# Altium schematic sheet TOP.SchDoc
size A4; SheetNumber: 1; SheetTotal: 12
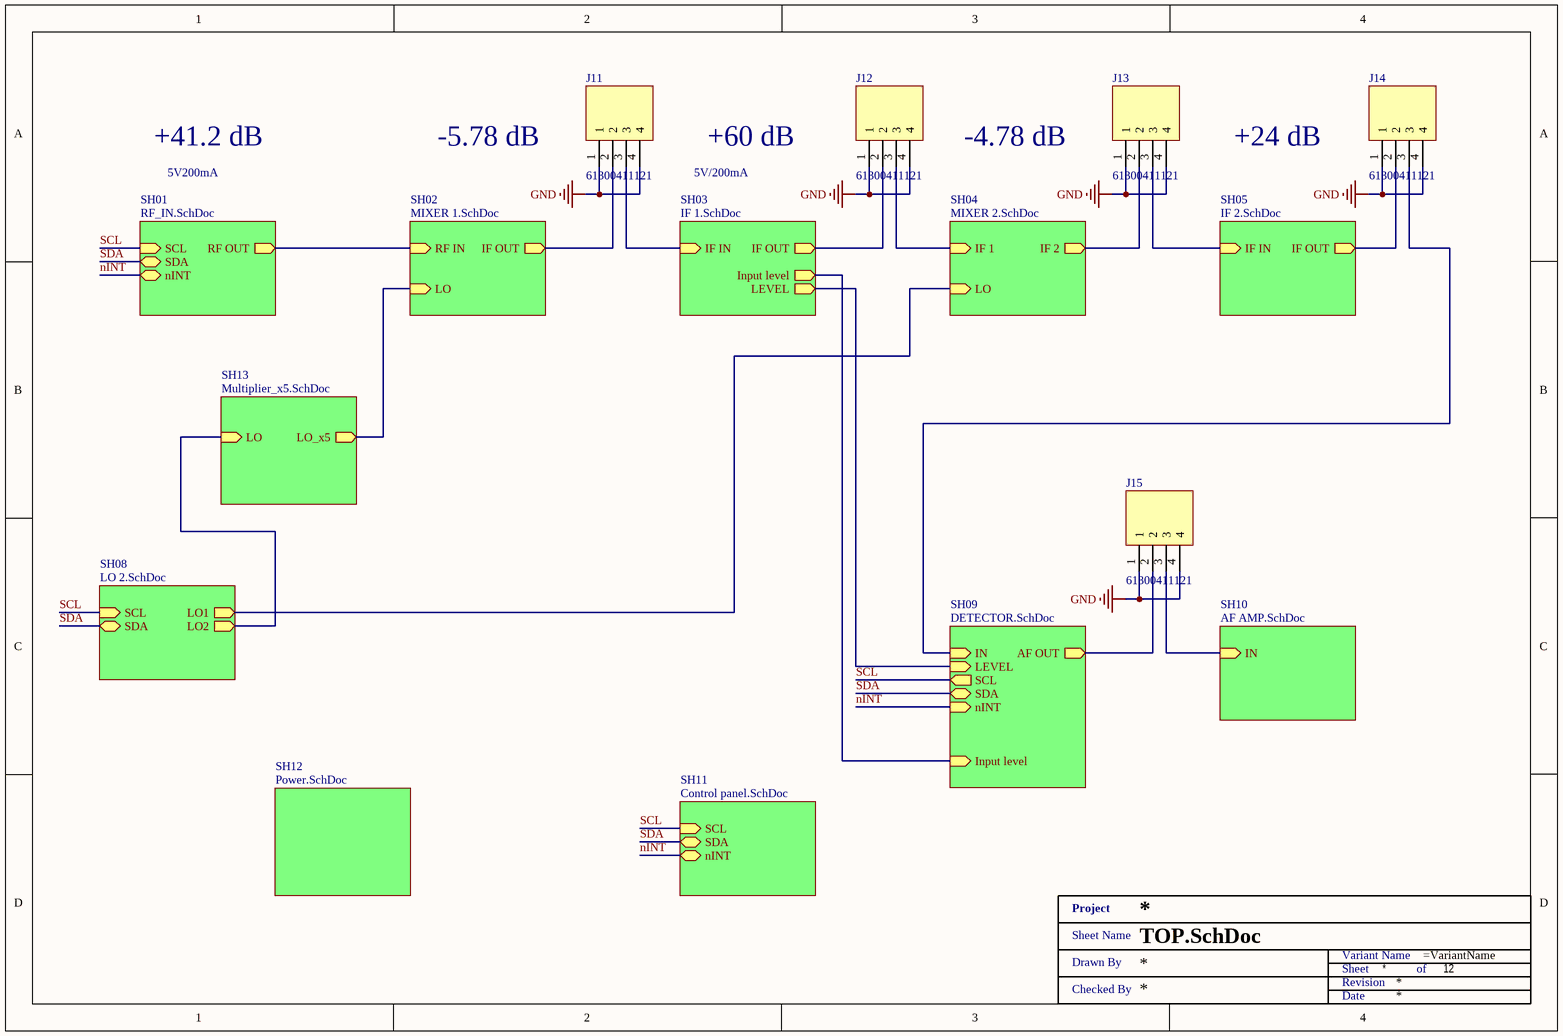
[diagram p0: TOP.SchDoc]

## Parts
J11  61300411121  [Header 4 2.54mm]
J12  61300411121  [Header 4 2.54mm]
J13  61300411121  [Header 4 2.54mm]
J14  61300411121  [Header 4 2.54mm]
J15  61300411121  [Header 4 2.54mm]
XX?  Title 1  (value not drawn)  (graphical)

## Sub-sheets
SH01 = RF_IN.SchDoc: RF OUT (out), SCL (in), SDA (bidir), nINT (bidir)
SH02 = MIXER 1.SchDoc: RF IN (in), IF OUT (out), LO (in)
SH03 = IF 1.SchDoc: IF IN (in), IF OUT (out), LEVEL (out), Input level (out)
SH04 = MIXER 2.SchDoc: IF 1 (in), IF 2 (out), LO (in)
SH05 = IF 2.SchDoc: IF IN (in), IF OUT (out)
SH08 = LO 2.SchDoc: SCL (in), SDA (bidir), LO1 (out), LO2 (out)
SH09 = DETECTOR.SchDoc: IN (in), AF OUT (out), SCL (out), SDA (bidir), nINT (in), LEVEL (in), Input level (in)
SH10 = AF AMP.SchDoc: IN (in)
SH11 = Control panel.SchDoc: SCL (in), SDA (bidir), nINT (bidir)
SH12 = Power.SchDoc: no entries
SH13 = Multiplier_x5.SchDoc: LO_x5 (out), LO (in)

## Nets
GND: J11.1 J11.4 J12.1 J12.4 J13.1 J13.4 J14.1 J14.4 J15.1 J15.4
nINT: sheet SH01/nINT, sheet SH09/nINT, sheet SH11/nINT
SCL: sheet SH01/SCL, sheet SH09/SCL, sheet SH08/SCL, sheet SH11/SCL
SDA: sheet SH01/SDA, sheet SH09/SDA, sheet SH08/SDA, sheet SH11/SDA
NetJ11_2: J11.2 ; sheet SH02/IF OUT
NetJ11_3: J11.3 ; sheet SH03/IF IN
NetJ12_2: J12.2 ; sheet SH03/IF OUT
NetJ12_3: J12.3 ; sheet SH04/IF 1
NetJ13_2: J13.2 ; sheet SH04/IF 2
NetJ13_3: J13.3 ; sheet SH05/IF IN
NetJ14_2: J14.2 ; sheet SH05/IF OUT
NetJ14_3: J14.3 ; sheet SH09/IN
NetJ15_2: J15.2 ; sheet SH09/AF OUT
NetJ15_3: J15.3 ; sheet SH10/IN
(unnamed): sheet SH01/RF OUT, sheet SH02/RF IN
(unnamed): sheet SH02/LO, sheet SH13/LO_x5
(unnamed): sheet SH03/LEVEL, sheet SH09/LEVEL
(unnamed): sheet SH03/Input level, sheet SH09/Input level
(unnamed): sheet SH04/LO, sheet SH08/LO1
(unnamed): sheet SH08/LO2, sheet SH13/LO

## Notes on the sheet
- +41.2 dB
- 5V200mA
- (near J11) -5.78 dB
- 5V/200mA
- +60 dB
- -4.78 dB
- +24 dB
- (in symbol Title 1) Project; Sheet Name; Variant Name; Drawn By; Sheet; of; Revision; Checked By; Date

## Library data of the parts
J11-J15 = 61300411121: CONN HEADER 4 POS 2.54; Manufacturer: Wurth Electronics Inc.; Pitch - Mating: 0.100" (2.54mm); Number of Positions: 4; Number of Positions Loaded: All; Style: Board to Board or Cable; Shrouding: Unshrouded; Contact Length - Mating: 0.236" (6.00mm); Contact Length - Post: 0.118" (3.00mm); Overall Contact Length: 0.454" (11.54mm); Material Flammability Rating: UL94 V-0; Current Rating: 3A; Voltage Rating: 250V; Manufacturer Part Number: 61300411121; RoHS: RoHS Compliant; Category: Connectors, Interconnects; Stock 1: 22863; Pricing 1: 1=0.18, 10=0.153, 25=0.1272, 50=0.106, 100=0.096, 1000=0.088 (USD); Packaging: Bulk; Part Status: Active; Connector Type: Header; Contact Type: Male Pin; Number of Rows: 1; Row Spacing - Mating: -; Mounting Type: Through Hole; Termination: Solder; Fastening Type: Push-Pull; Insulation Height: 0.100" (2.54mm); Contact Shape: Square; Contact Finish - Mating: Gold; Contact Finish Thickness - Mating: -; Contact Finish - Post: -; Contact Material: Copper Alloy; Insulation Material: Polybutylene Terephthalate (PBT); Features: -; Operating Temperature: -40°C ~ 125°C; Ingress Protection: -; Insulation Color: Black; Mated Stacking Heights: -; Contact Finish Thickness - Post: -; Applications: -; ComponentLink1URL: https://katalog.we-online.de/em/datasheet/6130xx11121.pdf; ComponentLink1Description: https://katalog.we-online.de/em/datasheet/6130xx11121.pdf; Supplier 1: Mouser; Supplier Part Number 1: 710-61300411121; Supplier 2: Farnell; Supplier Part Number 2: 2356155; Supplier 3: Digi-Key; Supplier Part Number 3: 732-5317-ND